# Altium project AD8307_Add_on_v3.PrjPcb
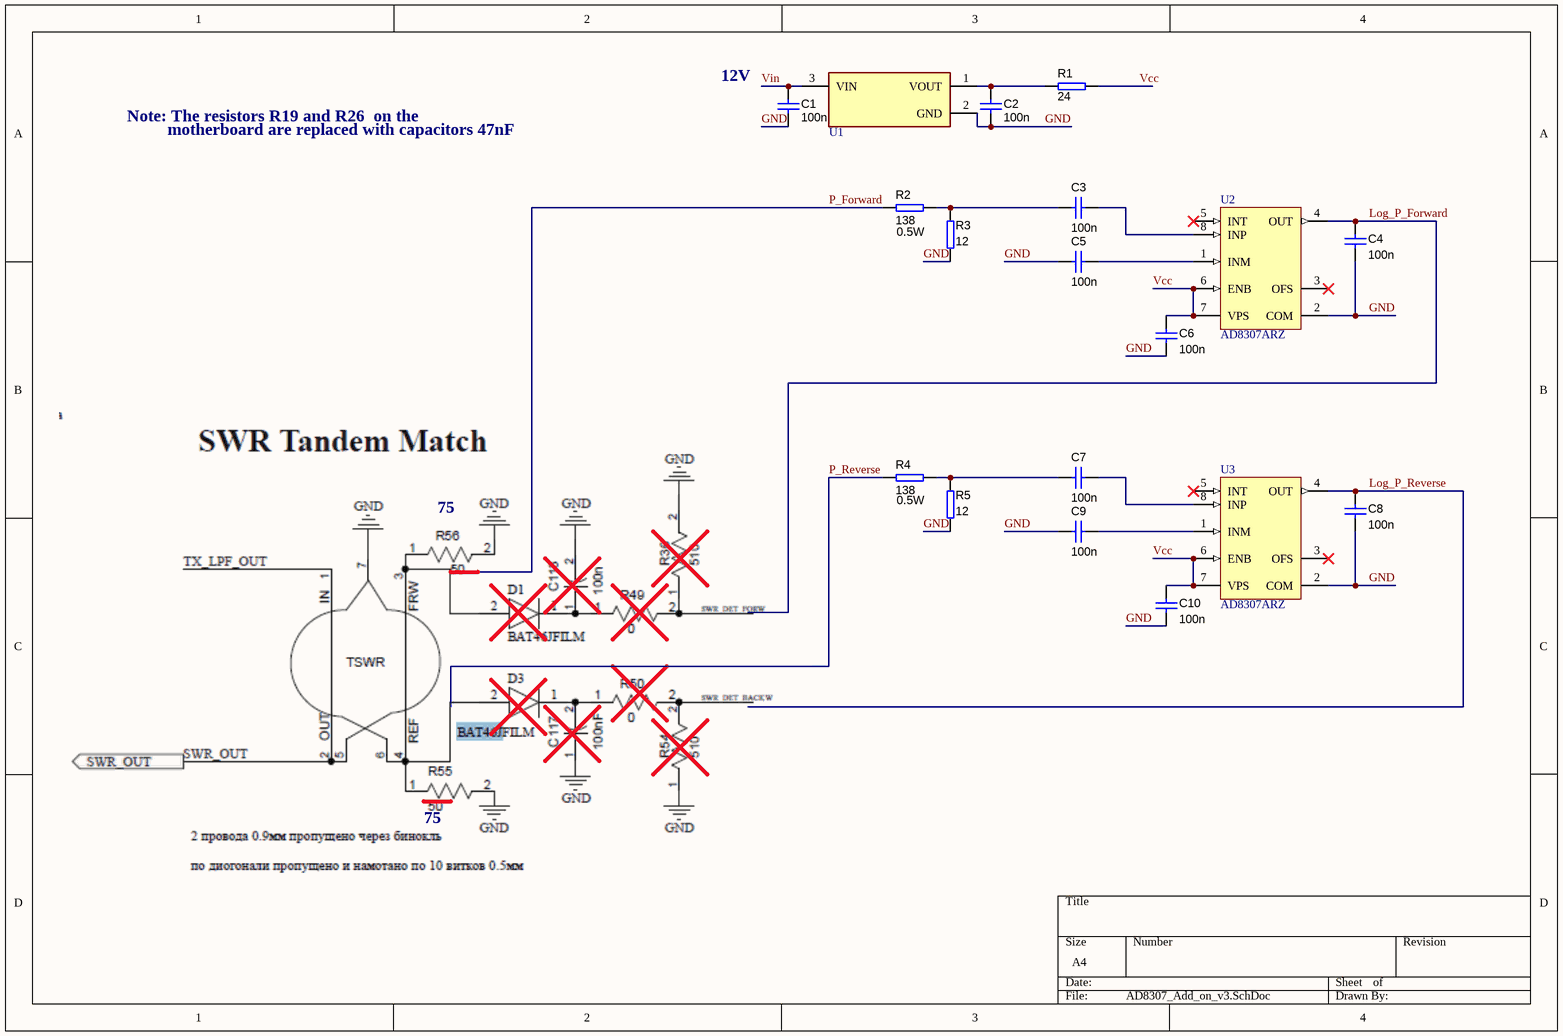
[diagram p0: AD8307_Add_on_v3.SchDoc]
1 sheet, 18 parts. Net scope: hierarchical (ports join the sheet entries above them; power ports are global).
Board file: AD8307_Add_on_v3.PcbDoc

## Sheet AD8307_Add_on_v3.SchDoc
size A4

### Parts
C1  value 100n  [0805_HV]
C2  value 100n  [0805_HV]
C3  value 100n  [0805_HV]
C4  value 100n  [0805_HV]
C5  value 100n  [0805_HV]
C6  value 100n  [0805_HV]
C7  value 100n  [0805_HV]
C8  value 100n  [0805_HV]
C9  value 100n  [0805_HV]
C10  value 100n  [0805_HV]
R1  value 24  [0805_HV]
R2  value 138  Value2: 0.5W  [1206]
R3  value 12  [0805_HV]
R4  value 138  Value2: 0.5W  [1206]
R5  value 12  [0805_HV]
U1  L78L05ACUTR  [STMicroelectronics_SOT-89-7098166_MFG]  (value not drawn)
U2  AD8307ARZ  [ADI-R-8_M]
U3  AD8307ARZ  [ADI-R-8_M]

### Nets
GND: C1.2 C2.2 C4.2 C5.2 C6.2 C8.2 C9.2 C10.2 R3.1 R5.1 U1.2(GND) U2.2(COM) U3.2(COM)
Log_P_Forward: C4.1 U2.4(OUT)
Log_P_Reverse: C8.1 U3.4(OUT)
P_Forward: R2.1
P_Reverse: R4.1
Vcc: C6.1 C10.1 R1.1 U2.6(ENB) U2.7(VPS) U3.6(ENB) U3.7(VPS)
Vin: C1.1 U1.3(VIN)
NetC2_1: C2.1 R1.2 U1.1(VOUT)
NetC3_1: C3.1 U2.8(INP)
NetC3_2: C3.2 R2.2 R3.2
NetC5_1: C5.1 U2.1(INM)
NetC7_1: C7.1 U3.8(INP)
NetC7_2: C7.2 R4.2 R5.2
NetC9_1: C9.1 U3.1(INM)

Not connected (* = marked no-connect by the designer): U2 3(OFS)* 5(INT)*; U3 3(OFS)* 5(INT)*

### Notes on the sheet
- (near C1) 12V
- Note: The resistors R19 and R26  on the
- motherboard are replaced with capacitors 47nF
- 75

### Library data of the parts
C1-C10 = C0805: CAP, CERM, +/- 10%, X7S,  0805; CompType: Capacitor; Tolerance_%: 10; SizeArea_mm2: 2.5; SizeAreaWB_mm2: 6.75; SizeX_mm: 2; SizeY_mm: 1.25; SizeZ_mm: 1.45; Value1: 50V; PackageReference: 0805; MountType: SMT; Technology: Ceramic; TempCo: X7S
R1 R3 R5 = R0805: RES, 1%, 0.1 W, 0805; SizeX_mm: 2; SizeY_mm: 1.25; SizeZ_mm: 0.75; PackageReference: 0805; Value1: 1%; MountType: SMT
R2 R4 = R1206: RES, 1%, 0.5 W, 1206; CompType: Resistor; Tolerance_%: 1; TempCo: 100 ppm/C; SizeArea_mm2: 5.12; SizeX_mm: 3.2; SizeY_mm: 1.6; SizeZ_mm: 1.35; PackageReference: 1206; Value1: 1%; MountType: SMT; Technology: Thick Film
U2 U3 = AD8307ARZ: Low Cost, DC to 500 MHz, 92 dB Logarithmic Amplifier, 400ns Response Time, R-8, Pb-Free, 98 Tube; Voltage Supply (V): 2.7 to 5.5; Product Description: High Dynamic Range; Supply Current: 8mA; Temp Stability (dB): 1dB; Dynamic Range (dB): 92dB; ComponentLink1Description: Manufacturer URL; ComponentLink2Description: Datasheet; DatasheetVersion: Rev. D; ComponentLink3URL: http://www.analog.com/static/imported-files/packages/PKG_PDF/SOIC_Narrow%20(R)/R_8.pdf; ComponentLink3Description: Package Specification; ComponentLink1URL: www.analog.com; Response Time (ns typ): 400ns; PackageVersion: 060506-A; PackageReference: R-8; PackageDescription: 8-Lead Standard Small Outline Package [SOIC_N]; ComponentLink2URL: http://www.analog.com/static/imported-files/data_sheets/AD8307.pdf; RF Frequency (MHz): dc to 500; Code_JEDEC: MS-012-AA; PartNumber: AD8307ARZ